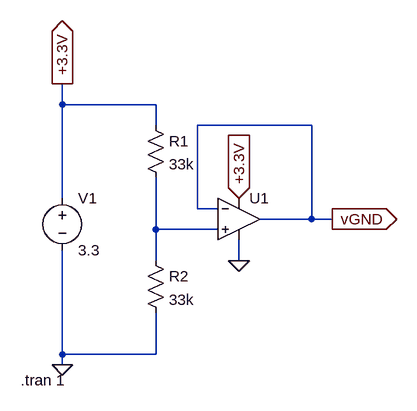
[diagram p0: schematic VGround.asc]
VGround.asc, the LTspice schematic file:
Version 4
SHEET 1 880 680
WIRE 64 -16 64 -48
WIRE 208 -16 64 -16
WIRE 208 16 208 -16
WIRE 448 16 272 16
WIRE 64 128 64 -16
WIRE 272 144 272 16
WIRE 304 144 272 144
WIRE 448 160 448 16
WIRE 448 160 368 160
WIRE 480 160 448 160
WIRE 208 176 208 96
WIRE 304 176 208 176
WIRE 208 224 208 176
WIRE 336 224 336 192
WIRE 64 368 64 208
WIRE 208 368 208 304
WIRE 208 368 64 368
WIRE 64 384 64 368
FLAG 336 224 0
FLAG 336 128 +3.3V
IOPIN 336 128 In
FLAG 64 -48 +3.3V
IOPIN 64 -48 Out
FLAG 64 384 0
FLAG 480 160 vGND
IOPIN 480 160 Out
SYMBOL voltage 64 112 R0
WINDOW 123 0 0 Left 0
WINDOW 39 0 0 Left 0
SYMATTR InstName V1
SYMATTR Value 3.3
SYMBOL OpAmps\\UniversalOpAmp2 336 160 R0
SYMATTR InstName U1
SYMBOL res 192 0 R0
SYMATTR InstName R1
SYMATTR Value 33k
SYMBOL res 192 208 R0
SYMATTR InstName R2
SYMATTR Value 33k
TEXT 0 408 Left 2 !.tran 1

The netlist it stands for:
* VGround.asc
V1 +3.3V 0 3.3
XU1 N001 vGND +3.3V 0 vGND level2 Avol=1Meg GBW=10Meg Slew=10Meg Ilimit=25m Rail=0 Vos=0 En=0 Enk=0 In=0 Ink=0 Rin=500Meg  ; pins In+ In- V+ V- OUT
R1 +3.3V N001 33k
R2 N001 0 33k
.tran 1
.lib UniversalOpAmp2.lib
.backanno
.end